# EAGLE design Main Shield (EAGLE 6.2)
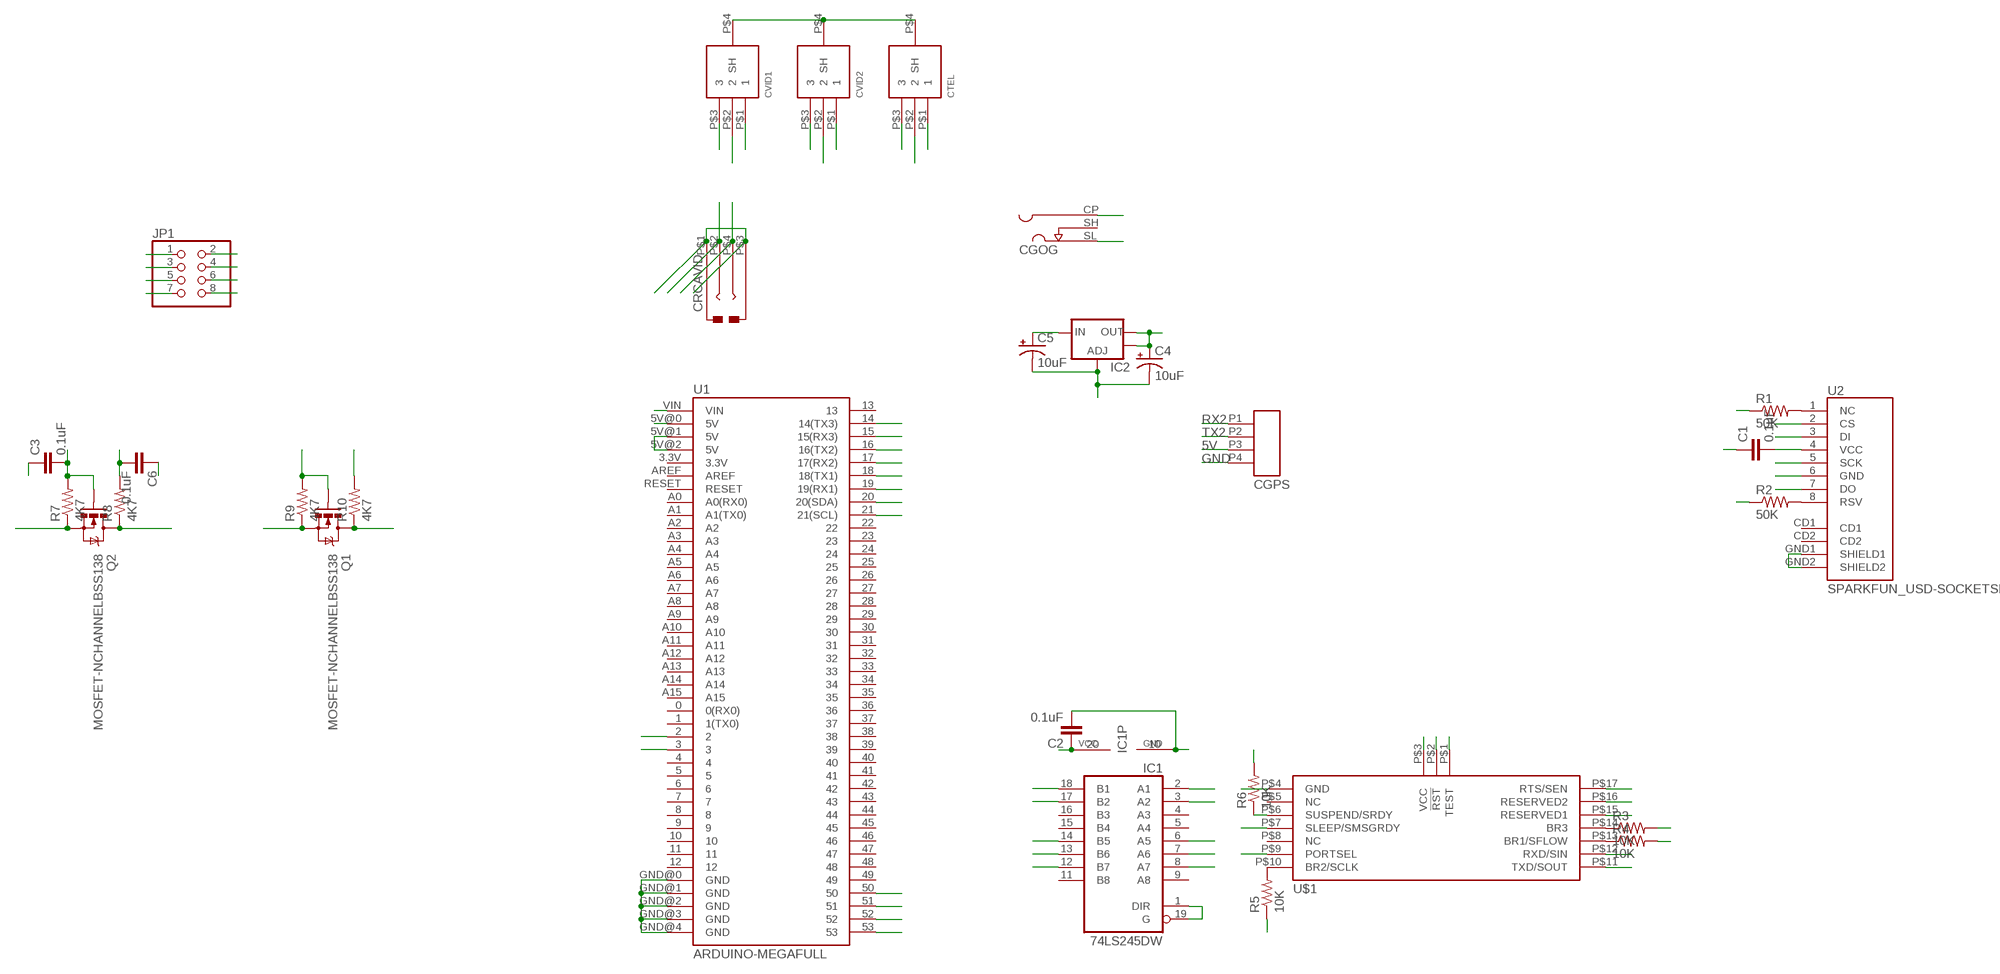
[diagram p0: schematic, sheet 1]

## Parts
C1  0.1uF  0.1UF-25V(+80/-20%)(0603)  [0603-CAP]
C2  0.1uF  0.1UF-25V(+80/-20%)(0603)  [0603-CAP]
C3  0.1uF  0.1UF-25V(+80/-20%)(0603)  [0603-CAP]
C4  10uF  10UF-TANT  [EIA3216]
C5  10uF  10UF-TANT  [EIA3216]
C6  0.1uF  0.1UF-25V(+80/-20%)(0603)  [0603-CAP]
CGOG  L722RAS  [L722RAS]
CGPS  TRAPC4MSX  [TRAPC4MSX]
CRCAVID  RCJ-2123  [RCJ-2123]
CTEL  TRA3M  [TRA3M]
CVID1  TRA3M  [TRA3M]
CVID2  TRA3M  [TRA3M]
IC1  74LS245DW  [SO20W]
IC2  V_REG_LM1117SOT223  [SOT223]
JP1  PINHD-2X04_MICROMATCH  [MICROMATCH-8]
Q1  MOSFET-NCHANNELBSS138  [SOT23]
Q2  MOSFET-NCHANNELBSS138  [SOT23]
R1  50K  RESISTOR0603-RES  [0603-RES]
R2  50K  RESISTOR0603-RES  [0603-RES]
R3  10K  RESISTOR0603-RES  [0603-RES]
R4  10K  RESISTOR0603-RES  [0603-RES]
R5  10K  RESISTOR0603-RES  [0603-RES]
R6  10K  RESISTOR0603-RES  [0603-RES]
R7  4K7  RESISTOR0603-RES  [0603-RES]
R8  4K7  RESISTOR0603-RES  [0603-RES]
R9  4K7  RESISTOR0603-RES  [0603-RES]
R10  4K7  RESISTOR0603-RES  [0603-RES]
U1  ARDUINO-MEGAFULL  [ARDUINO_MEGA]
U2  SPARKFUN_USD-SOCKETSMD  [SPARKFUN_MICRO-SD-SOCKET-PP]
U$1  ANTAP281MXIB  [ANTAP281MXIB]

## Nets
3V3: C1.2 C2.1 C3.2 C4.A(+) IC1.20(VCC) IC2.2(OUT) IC2.4(OUT) JP1.2 Q1.1(G) Q2.1(G) R1.1 R2.1 R3.2 R4.2 R5.1 R6.2 R7.2 R9.2 U2.4(VCC) U$1.P$3(VCC)
5V: C5.A(+) C6.2 CGPS.P3 CVID1.P$1 CVID2.P$1 IC2.3(IN) JP1.4 R8.2 R10.2 U1.5V@0(5V) U1.5V@1(5V) U1.5V@2(5V)
!RST!ANT: IC1.3(A2) U$1.P$2(!RST!)
!RST!ANT5V: IC1.17(B2) U1.3
CSMMC: IC1.8(A7) U2.2(CS)
DIMMC: IC1.7(A6) U2.3(DI)
DOMMC: U1.50 U2.7(DO)
GND: C1.1 C2.2 C3.1 C4.C(-) C5.C(-) C6.1 CGOG.SL(SLEEVE) CGPS.P4 CRCAVID.P$1 CRCAVID.P$3 CTEL.P$3 CTEL.P$4(SH) CVID1.P$3 CVID1.P$4(SH) CVID2.P$3 CVID2.P$4(SH) IC1.1(DIR) IC1.10(GND) IC1.19(G) IC2.1(ADJ) JP1.1 JP1.3 U1.GND@0(GND) U1.GND@1(GND) U1.GND@2(GND) U1.GND@3(GND) U1.GND@4(GND) U2.6(GND) U2.GND1(SHIELD1) U2.GND2(SHIELD2) U$1.P$1(TEST) U$1.P$4(GND) U$1.P$7(SLEEP/SMSGRDY) U$1.P$9(PORTSEL) U$1.P$15(RESERVED1) U$1.P$16(RESERVED2)
MOSI: IC1.13(B6) U1.51
N$1: R1.2 U2.1(NC)
N$2: R2.2 U2.8(RSV)
N$3: R3.1 U$1.P$14(BR3)
N$4: R4.1 U$1.P$13(BR1/SFLOW)
N$5: R5.2 U$1.P$10(BR2/SCLK)
N$6: R6.1 U$1.P$6(SUSPEND/SRDY)
RTSANT: U1.2 U$1.P$17(RTS/SEN)
RX2: CGPS.P1 U1.17(17(RX2))
RXANT: IC1.2(A1) U$1.P$12(RXD/SIN)
RXOSD: CTEL.P$2 U1.14(14(TX3))
SCK: IC1.14(B5) U1.52
SCKMMC: IC1.6(A5) U2.5(SCK)
SCL3V3: JP1.7 Q1.2(S) R9.1
SCL5V: JP1.8 Q1.3(D) R10.1 U1.21(21(SCL))
SDA3V3: JP1.5 Q2.2(S) R7.1
SDA5V: JP1.6 Q2.3(D) R8.1 U1.20(20(SDA))
SS: IC1.12(B7) U1.53
TX1: IC1.18(B1) U1.18(18(TX1))
TX2: CGPS.P2 U1.16(16(TX2))
TXANT: U1.19(19(RX1)) U$1.P$11(TXD/SOUT)
TXOSD: CTEL.P$1 U1.15(15(RX3))
VBAT: CGOG.CP(CENTRE) U1.VIN
VID1: CRCAVID.P$2 CVID1.P$2
VID2: CRCAVID.P$4 CVID2.P$2
Unconnected: CGOG.SH(SHUNT) IC1.4(A3) IC1.5(A4) IC1.9(A8) IC1.11(B8) IC1.15(B4) IC1.16(B3) U1.0(0(RX0)) U1.1(1(TX0)) U1.3.3V U1.4 U1.5 U1.6 U1.7 U1.8 U1.9 U1.10 U1.11 U1.12 U1.13 U1.22 U1.23 U1.24 U1.25 U1.26 U1.27 U1.28 U1.29 U1.30 U1.31 U1.32 U1.33 U1.34 U1.35 U1.36 U1.37 U1.38 U1.39 U1.40 U1.41 U1.42 U1.43 U1.44 U1.45 U1.46 U1.47 U1.48 U1.49 U1.A0(A0(RX0)) U1.A1(A1(TX0)) U1.A2 U1.A3 U1.A4 U1.A5 U1.A6 U1.A7 U1.A8 U1.A9 U1.A10 U1.A11 U1.A12 U1.A13 U1.A14 U1.A15 U1.AREF U1.RESET U2.CD1 U2.CD2 U$1.P$5(NC) U$1.P$8(NC)

## Library data of the parts
C1-C3 C6 = SparkFun-Capacitors:0.1UF-25V(+80/-20%)(0603): Ceramic Standard decoupling cap CAP-00810; PROD_ID: CAP-00810
C4 C5 = SparkFun-Capacitors:10UF-TANT: 10uF Tantalum SMT CAP-00811- 16V 10% (EIA-3216); PROD_ID: CAP-00811
CGOG = custom-parts:L722RAS
CGPS = custom-parts:TRAPC4MSX
CRCAVID = custom-parts:RCJ-2123
CTEL CVID1 CVID2 = custom-parts:TRA3M
IC1 = adafruit:74*245: Octal BUS TRANSCEIVER, 3-state
IC2 = SparkFun-PowerIC:V_REG_LM1117: Voltage Regulator LM1117 Standard adjustable voltage regulator but in SMD form. Spark Fun Electronics SKU : COM-00595
JP1 = pinhead-2:PINHD-2X04: PIN HEADER
Q1 Q2 = SparkFun-DiscreteSemi:MOSFET-NCHANNEL: Common NMOSFET Parts MFG P/N Store ID Prod ID FDD8780 TRANS-09984 SI7820DN TRANS-11055 FDS6630A IC-08089 2N7002PW TRANS-11151 FQP30N06L COM-10213 TRANS-10060 BSS123LT1G TRANS-08345 BSS138 TRANS-00830 BS170 2N7000; PROD_ID: TRANS-00830
R1-R10 = SparkFun-Passives:RESISTOR: Resistor Basic schematic elements and footprints for 0603, 1206, and PTH resistors.
U1 = custom-parts:ARDUINO-MEGA: Arduino Mega board footprint
U2 = microSD-Breakout-v14:SPARKFUN_USD-SOCKET: microSD Socket Push-push type uSD socket. Schematic element and footprint production proven. Spark Fun Electronics SKU : PRT-00127. tDoc lines correctly indicate media card edge positions when inserting (unlocked, locked, depressed).
U$1 = custom-parts:ANTAP281MXIB

## Board
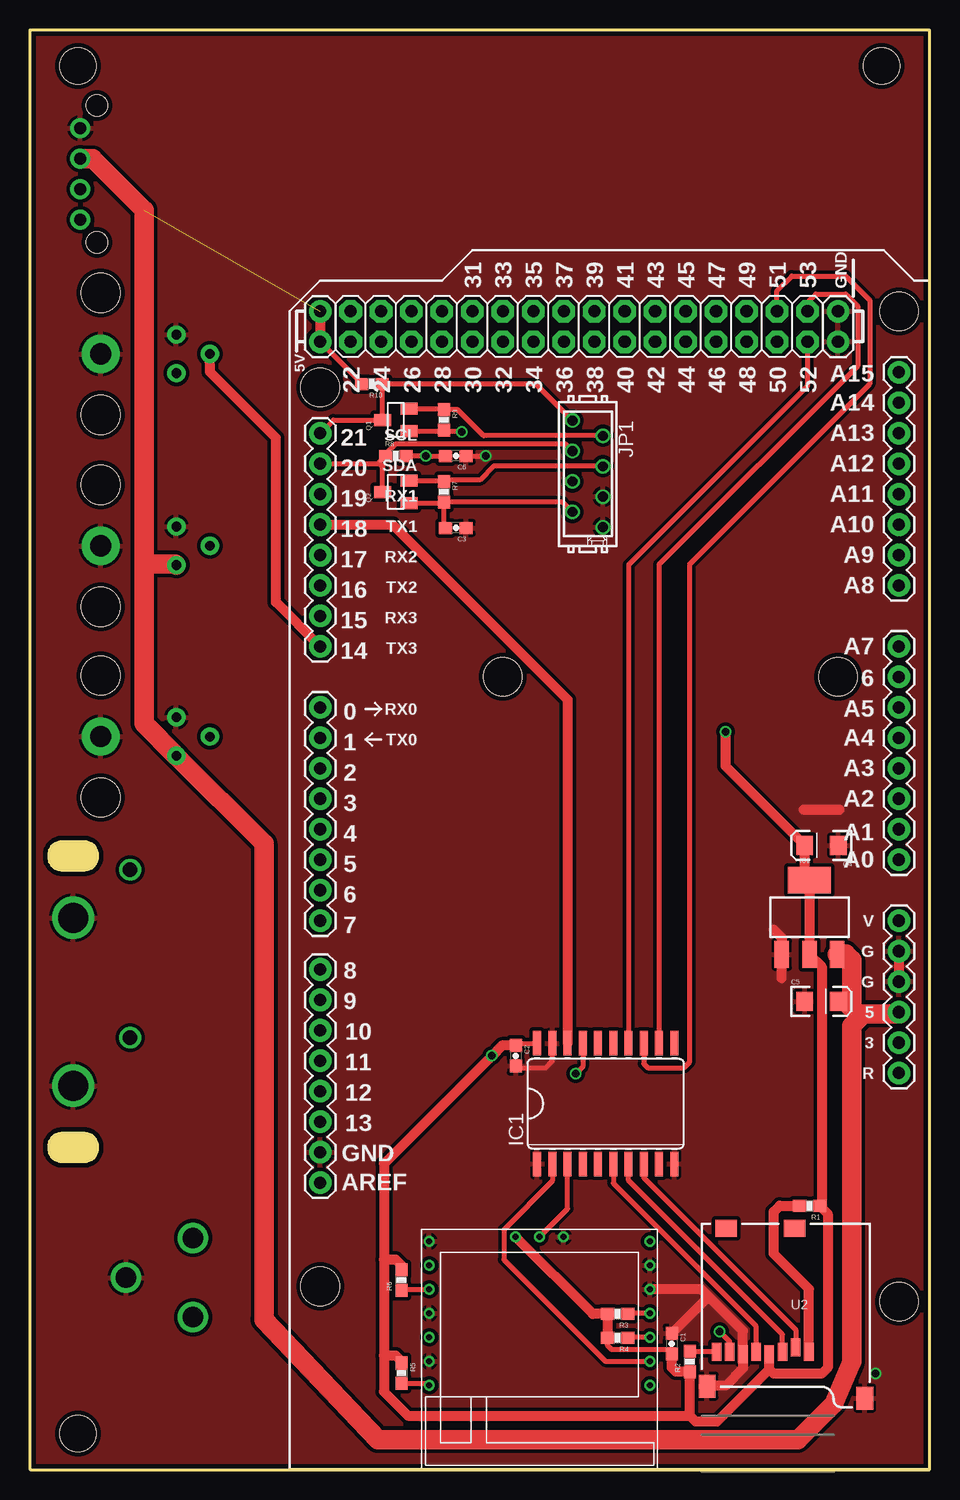
[diagram p1: board, top side]
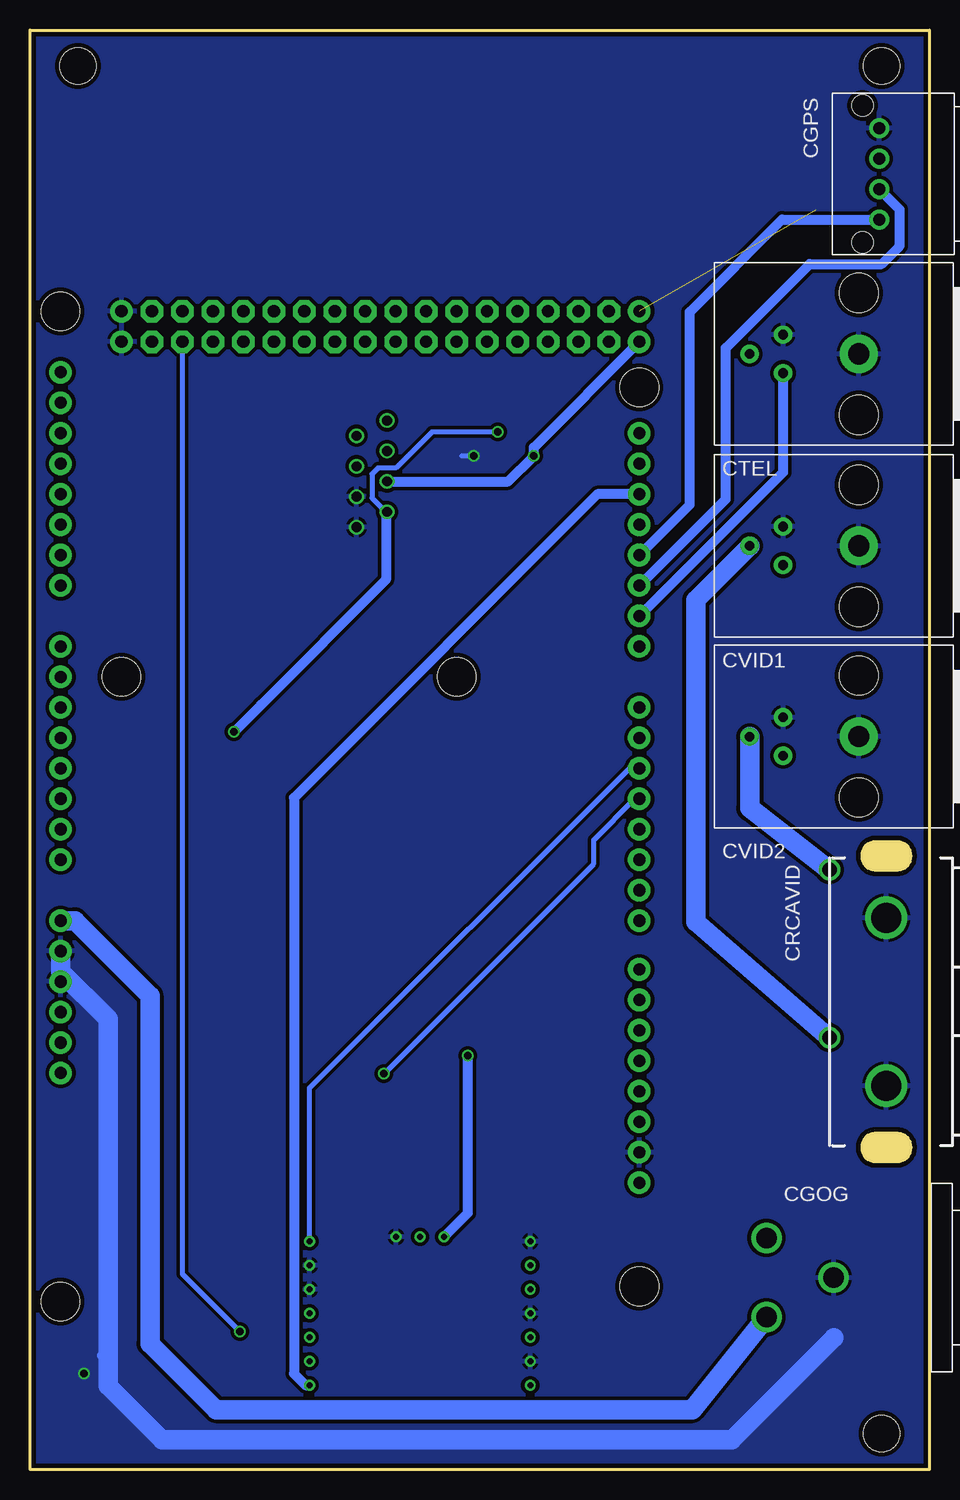
[diagram p2: board, bottom side, seen from below]

Size 75 x 120 mm. Coordinates in mm from the lower left corner, seen from the top.
Outline: 0,0 75,0 75,120 0,120 0,0
Copper layers (1*16): Top 0.0356mm / dielectric 1.5011mm / Bottom 0.0356mm
Design rules: minimum track width 6mil, minimum drill 13mil, track to track 6mil, track to pad 6mil, pad to pad 6mil, via to via 6mil, smd to smd 6mil, copper to edge 15mil, drill to drill 6mil, minimum pad ring 7mil, minimum via ring 7mil, stop-mask expansion 4mil, vias tented up to drill 0mil, thermal gap 10mil
Holes 3 mm at 4,3 4,117 71,117

### Footprints (pad centres in the part's own frame; a part is rotated, then mirrored left to right if it is on the bottom)
0603-CAP = smd 1.1 x 1: 1 -0.85,0; 2 0.85,0
EIA3216 = smd 1.4 x 1.6: A 1.4,0; C -1.4,0
L722RAS = drill 1.7: CP 5.588,3.302; SH 5.588,-3.302; SL 0,0
TRAPC4MSX = drill 1.016 pad 1.676: P1 3.81,0; P2 1.27,0; P3 -1.27,0; P4 -3.81,0 | hole 1.778: -5.715,-1.372; 5.715,-1.372
RCJ-2123 = drill 2.5: P$1 7,-5.5; P$3 -7,-5.5 | drill 1.2: P$2 3,-10.25; P$4 -11,-10.25
TRA3M = drill 0.8 pad 1.524: P$1 0,-1.6; P$2 -2.794,0; P$3 0,1.6 | drill 1.778 pad 3.175: P$4 6.299,0 | hole 3.251: 6.299,5.08; 6.299,-5.08
SO20W = smd 0.66 x 2.032: 1 -5.715,-5.029; 2 -4.445,-5.029; 3 -3.175,-5.029; 4 -1.905,-5.029; 5 -0.635,-5.029; 6 0.635,-5.029; 7 1.905,-5.029; 8 3.175,-5.029; 9 4.445,-5.029; 10 5.715,-5.029; 11 5.715,5.029; 12 4.445,5.029; 13 3.175,5.029; 14 1.905,5.029; 15 0.635,5.029; 16 -0.635,5.029; 17 -1.905,5.029; 18 -3.175,5.029; 19 -4.445,5.029; 20 -5.715,5.029
SOT223 = smd 1.219 x 2.235: 1 -2.311,-3.099; 2 0,-3.099; 3 2.311,-3.099 | smd 3.6 x 2.2: 4 0,3.099
MICROMATCH-8 = drill 0.813: 1 4.445,1.27; 2 3.175,-1.27; 3 1.905,1.27; 4 0.635,-1.27; 5 -0.635,1.27; 6 -1.905,-1.27; 7 -3.175,1.27; 8 -4.445,-1.27
SOT23 = smd 1 x 1.4: 1 -0.95,-1.1; 2 0.95,-1.1; 3 0,1.1
0603-RES = smd 1.1 x 1: 1 -0.85,0; 2 0.85,0
ARDUINO_MEGA = drill 1.016 pad 1.88: 0 63.5,50.8; 1 60.96,50.8; 2 58.42,50.8; 3 55.88,50.8; 3.3V 35.56,2.54; 4 53.34,50.8; 5 50.8,50.8; 5V@0 38.1,2.54; 5V@1 93.98,50.8; 5V@2 96.52,50.8; 6 48.26,50.8; 7 45.72,50.8; 8 41.656,50.8; 9 39.116,50.8; 10 36.576,50.8; 11 34.036,50.8; 12 31.496,50.8; 13 28.956,50.8; 14 68.58,50.8; 15 71.12,50.8; 16 73.66,50.8; 17 76.2,50.8; 18 78.74,50.8; 19 81.28,50.8; 20 83.82,50.8; 21 86.36,50.8; A0 50.8,2.54; A1 53.34,2.54; A2 55.88,2.54; A3 58.42,2.54; A4 60.96,2.54; A5 63.5,2.54; A6 66.04,2.54; A7 68.58,2.54; A8 73.66,2.54; A9 76.2,2.54; A10 78.74,2.54; A11 81.28,2.54; A12 83.82,2.54; A13 86.36,2.54; A14 88.9,2.54; A15 91.44,2.54; AREF 23.876,50.8; GND@0 40.64,2.54; GND@1 43.18,2.54; GND@2 93.98,7.62; GND@3 96.52,7.62; GND@4 26.416,50.8; RESET 33.02,2.54; VIN 45.72,2.54 | drill 1.016 pad 1.88 octagon: 22 93.98,48.26; 23 96.52,48.26; 24 93.98,45.72; 25 96.52,45.72; 26 93.98,43.18; 27 96.52,43.18; 28 93.98,40.64; 29 96.52,40.64; 30 93.98,38.1; 31 96.52,38.1; 32 93.98,35.56; 33 96.52,35.56; 34 93.98,33.02; 35 96.52,33.02; 36 93.98,30.48; 37 96.52,30.48; 38 93.98,27.94; 39 96.52,27.94; 40 93.98,25.4; 41 96.52,25.4; 42 93.98,22.86; 43 96.52,22.86; 44 93.98,20.32; 45 96.52,20.32; 46 93.98,17.78; 47 96.52,17.78; 48 93.98,15.24; 49 96.52,15.24; 50 93.98,12.7; 51 96.52,12.7; 52 93.98,10.16; 53 96.52,10.16 | hole 3.2: 15.24,50.8; 13.97,2.54; 66.04,35.56; 66.04,7.62; 90.17,50.8; 96.52,2.54
SPARKFUN_MICRO-SD-SOCKET-PP = smd 0.8 x 1.5: 1 -8.94,10.7; 2 -7.84,10.3; 3 -6.74,10.7; 4 -5.64,10.9; 5 -4.54,10.7; 6 -3.44,10.9; 7 -2.34,10.7; 8 -1.24,10.7 | smd 1.8 x 1.4: CD1 -7.75,0.4; CD2 -2.05,0.4 | smd 1.4 x 1.9: GND1 -13.6,14.55; GND2 -0.45,13.55
ANTAP281MXIB = drill 0.5 pad 0.9: P$1 2,-0.63; P$2 0,-0.63; P$3 -2,-0.63; P$4 -9.2,-1; P$5 -9.2,-3; P$6 -9.2,-5; P$7 -9.2,-7; P$8 -9.2,-9; P$9 -9.2,-11; P$10 -9.2,-13; P$11 9.2,-13; P$12 9.2,-11; P$13 9.2,-9; P$14 9.2,-7; P$15 9.2,-5; P$16 9.2,-3; P$17 9.2,-1

### Placement (x,y rotation side)
C1  53.5,10.5 270 top
C2  40.5,34.5 270 top
C3  35.5,78.5 180 top
C4  65.99,52.03 180 top
C5  65.99,39.03 0 top
C6  35.5,84.5 180 top
CGOG  8,16 180 bottom
CGPS  4.2,108 270 bottom
CRCAVID  -1.9,39 270 bottom
CTEL  12.2,93 0 bottom
CVID1  12.2,77 0 bottom
CVID2  12.2,61.1 0 bottom
IC1  48,30.5 0 top
IC2  64.99,46.03 0 top
JP1  46.5,83 270 top
Q1  30.5,87.5 90 top
Q2  30.5,81.5 90 top
R1  65.01,21.97 180 top
R2  55,9 90 top
R3  49.01,12.97 180 top
R4  49.01,10.97 180 top
R5  30.99,8.03 270 top
R6  30.96,15.8 90 top
R7  34.5,81.5 270 top
R8  30.5,84.5 0 top
R9  34.5,87.5 270 top
R10  28.5,90.5 180 top
U1  74.99,0.03 90 top
U2  56,20.5 180 top
U$1  42.49,20.03 0 top

### Tracks (layer width: path | path; a pad name or v marks a point on that pad's centre or on a via)
3V3  (via drill 0.6)
  Top 0.406: C2.1 40.5,35.53 IC1.20 | 30.65,16.65 R6.2 | C1.2 53.15,10 48.5,10 48.16,10.34 R4.2 | Q2.1 34.4,80.55 R7.2 | Q1.1 34.4,86.55 | 34.4,86.55 R9.2 | JP1.2 44.41,80.65 R7.2 | C3.2 34.5,78.65 R7.2 | 34.4,86.55 35.95,86.55 v36,86.5
  Top 0.813: 66,21.83 66,41.92 IC2.2 IC2.4 64.59,49.53 C4.A 58,58.62 v58,61.5 | U$1.P$3 46.92,12.97 R3.2 R4.2 | 61.64,8.36 62,8 66,8 66.5,8.5 66.5,21.33 66,21.83 | 61.64,8.36 U2.4 | 55,4.5 R2.1 53.85,8.15 53.5,8.5 53.5,9.5 | 61.64,8.36 57.28,4 55.5,4 55,4.5 | C2.1 39.35,35.35 v38.5,34.5 29.5,25.5 29.5,17.5 | 29.5,17.5 29.5,9.5 | 29.5,9.5 29.5,6.5 31.5,4.5 55,4.5 | R5.1 30.99,9.01 30.5,9.5 29.5,9.5 | R6.2 30.96,17.04 30.5,17.5 29.5,17.5 | 66,21.83 R1.1
  Bottom 0.406: v36,86.5 41.5,86.5 44.5,83.5 46,83.5 46.5,83 46.5,81 45.33,79.83 JP1.2
  Bottom 0.813: U$1.P$3 38.5,21.39 v38.5,34.5 | 45.33,79.83 45.33,74.17 55.75,63.75 v58,61.5
5V  (via drill 0.6)  (1 unrouted)
  Top 0.406: R8.2 v33,84.5 C6.2 | U1.5V@1 27.65,90.55 R10.2
  Top 0.813: U1.5V@0 68.29,38.13 C5.A 67.3,39.12 | U1.5V@2 U1.5V@1
  Top 1.626: IC2.3 67.37,43 68,43 68.5,42.5 68.5,38.5 69,38 69.5,38 | 72.5,38 72.32,38 | 72.32,38 69.5,38 | 69.5,38 68.5,37 68.5,9 67,5.5 64,2.5 29,2.5 19.5,12.5 19.5,52.2 CVID2.P$1 9.5,62.2 9.5,75.5 | 9.5,75.5 9.5,105 5.23,109.27 CGPS.P3 | U1.5V@0 72.32,38 | CVID1.P$1 12.1,75.5 9.5,75.5
  Bottom 0.813: JP1.4 35.13,82.36 v33,84.5 33,85.2 U1.5V@1
!RST!ANT
  Top 0.406: U$1.P$2 44.83,21.73 IC1.3
!RST!ANT5V  (via drill 0.6)
  Top 0.406: IC1.17 46.09,33.59 v45.5,33
  Bottom 0.406: v45.5,33 28,50.5 28,52.5 24.59,55.91 U1.3
CSMMC
  Top 0.406: U2.2 63.84,11.66 51.17,24.32 IC1.8
DIMMC
  Top 0.406: U2.3 62.74,11.26 49.91,24.09 IC1.7
DOMMC  (via drill 0.6)
  Top 0.406: U2.7 58.34,10.66 v57.5,11.5
  Bottom 0.406: v57.5,11.5 62.29,16.29 U1.50
GND  (via drill 0.6)
  Top 0.406: C2.2 40.5,33.5 43,33.5 43.55,34.05 IC1.19 | C6.1 v38,84.5
  Top 0.813: U1.GND@1 U1.GND@0 | 62.68,40.94 IC2.1 62.68,44.32 62,45 | 56.75,14.25 59.44,11.56 U2.6 59.44,8.44 58,7 56.5,7 U2.GND2 | 56.75,14.25 55.97,15.03 U$1.P$15 | C1.1 56.4,14.25 56.75,14.25 | 67.5,55 64.5,55
  Bottom 0.406: v38,84.5 39,84.5
  Bottom 0.813: 69,9.5 68.5,9.5
  Bottom 1.626: 8,11 16.5,2.5 64,2.5 68.5,7 68.5,9.5 68.5,37.55 72.45,41.5 U1.GND@1
  other vias: 70.5,8
  pour Top (isolate 0.305): 0,0 75,0 75,120 0,120
  pour Bottom (isolate 0.305): 0.5,120 75.5,120 75,0 0,0
MOSI
  Top 0.406: U1.51 62.29,98.29 63.5,99.5 68,99.5 70,97.5 70,90.5 55,75.5 55,34 54.5,33.5 51.5,33.5 51.17,33.83 IC1.13
N$1
  Top 0.813: U2.1 64.94,15.06 62,18 62,21.5 62.5,22 64.13,22 R1.2
N$2
  Top 0.406: U2.8 55.15,9.8 R2.2
N$3
  Top 0.406: U$1.P$14 49.92,13.03 R3.1
N$4
  Top 0.406: U$1.P$13 49.92,11.03 R4.1
N$5
  Top 0.406: R5.2 33.14,7.18 U$1.P$10
N$6
  Top 0.406: R6.1 31.04,15.03 U$1.P$6
RTSANT
  Bottom 0.406: U$1.P$17 51.69,31.81 25,58.5 24.24,58.5 U1.2
RX2
  Bottom 0.813: U1.17 20,80.42 20,96.5 12.31,104.19 CGPS.P1
RXANT
  Top 0.406: IC1.2 43.55,24.05 39.5,20 39.5,17.5 47.97,9.03 U$1.P$12
RXOSD
  Top 0.813: U1.14 20.5,72.3 20.5,86 15,91.5 CTEL.P$2
SCK
  Top 0.406: U1.52 64.83,90.33 49.91,75.41 IC1.14
SCKMMC
  Top 0.406: IC1.6 48.63,23.86 60.5,12 60.5,9.84 U2.5
SCL3V3
  Top 0.406: Q1.2 34.4,88.45 R9.1 35.65,88.35 37.83,86.17 JP1.7
SCL5V
  Top 0.406: U1.21 25.3,87.5 Q1.3 29.4,90.25 R10.1 42.17,90.5 JP1.8
SDA3V3
  Top 0.406: Q2.2 34.4,82.45 R7.1 34.65,82.5 37.5,82.5 38.63,83.64 JP1.5
SDA5V
  Top 0.406: U1.20 29,83.85 29.07,83.92 | 29.07,83.92 R8.1 29.65,84.65 30.5,85.5 44.63,85.5 JP1.6 | Q2.3 29.4,83.6 29.07,83.92
SS
  Top 0.406: U1.53 64.83,97.33 65.5,98 68,98 69,97 69,92 52.45,75.44 IC1.12
TX1
  Top 0.813: U1.18 30.23,78.77 44.83,64.17 IC1.18
TX2
  Bottom 0.813: U1.16 17,80.88 17,93.5 10,100.5 4,100.5 2.5,102 2.5,105.03 CGPS.P2
TXANT
  Bottom 0.813: U1.19 27.69,81.31 53,56 53,8 52.03,7.03 U$1.P$11
TXOSD
  Bottom 0.813: U1.15 12.2,83.14 CTEL.P$1
VBAT
  Bottom 1.626: CGOG.CP 19.79,5 59.5,5 65,10.5 65,39.5 71.25,45.75 U1.VIN
VID1
  Bottom 1.626: CRCAVID.P$2 19.5,45.65 19.5,72.49 CVID1.P$2
VID2
  Bottom 1.626: CVID2.P$2 14.99,55.14 CRCAVID.P$4